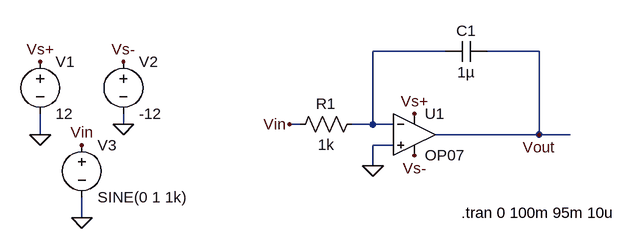
[diagram p0: schematic Integrator.asc]
Integrator.asc, the LTspice schematic file:
Version 4
SHEET 1 880 680
WIRE 432 64 320 64
WIRE 576 64 496 64
WIRE -64 176 -64 160
WIRE 208 176 192 176
WIRE 320 176 320 64
WIRE 320 176 288 176
WIRE 352 176 320 176
WIRE -192 192 -192 160
WIRE 576 192 576 64
WIRE 576 192 416 192
WIRE 624 192 576 192
WIRE 352 208 320 208
WIRE 320 240 320 208
WIRE -128 320 -128 288
FLAG 320 240 0
FLAG -128 320 0
FLAG -192 192 0
FLAG -64 176 0
FLAG 192 176 Vin
FLAG -128 208 Vin
FLAG -192 80 Vs+
FLAG 384 160 Vs+
FLAG -64 80 Vs-
FLAG 384 224 Vs-
FLAG 576 192 Vout
SYMBOL voltage -192 64 R0
WINDOW 123 0 0 Left 0
WINDOW 39 0 0 Left 0
SYMATTR InstName V1
SYMATTR Value 12
SYMBOL voltage -64 64 R0
WINDOW 123 0 0 Left 0
WINDOW 39 0 0 Left 0
SYMATTR InstName V2
SYMATTR Value -12
SYMBOL voltage -128 192 R0
WINDOW 123 0 0 Left 0
WINDOW 39 0 0 Left 0
SYMATTR InstName V3
SYMATTR Value SINE(0 1 1k)
SYMBOL OpAmps\\OP07 384 128 R0
SYMATTR InstName U1
SYMBOL res 304 160 R90
WINDOW 0 0 56 VBottom 2
WINDOW 3 32 56 VTop 2
SYMATTR InstName R1
SYMATTR Value 1k
SYMBOL cap 496 48 R90
WINDOW 0 0 32 VBottom 2
WINDOW 3 32 32 VTop 2
SYMATTR InstName C1
SYMATTR Value 1µ
TEXT 456 312 Left 2 !.tran 0 100m 95m 10u

The netlist it stands for:
* Integrator.asc
V1 Vs+ 0 12
V2 Vs- 0 -12
V3 Vin 0 SINE(0 1 1k)
XU1 0 N001 Vs+ Vs- Vout LT1001  ; OP07, pins In+ In- V+ V- OUT
R1 N001 Vin 1k
C1 Vout N001 1µ
.tran 0 100m 95m 10u
.lib LTC.lib
.backanno
.end